# Altium project ProjectC.PrjPCB
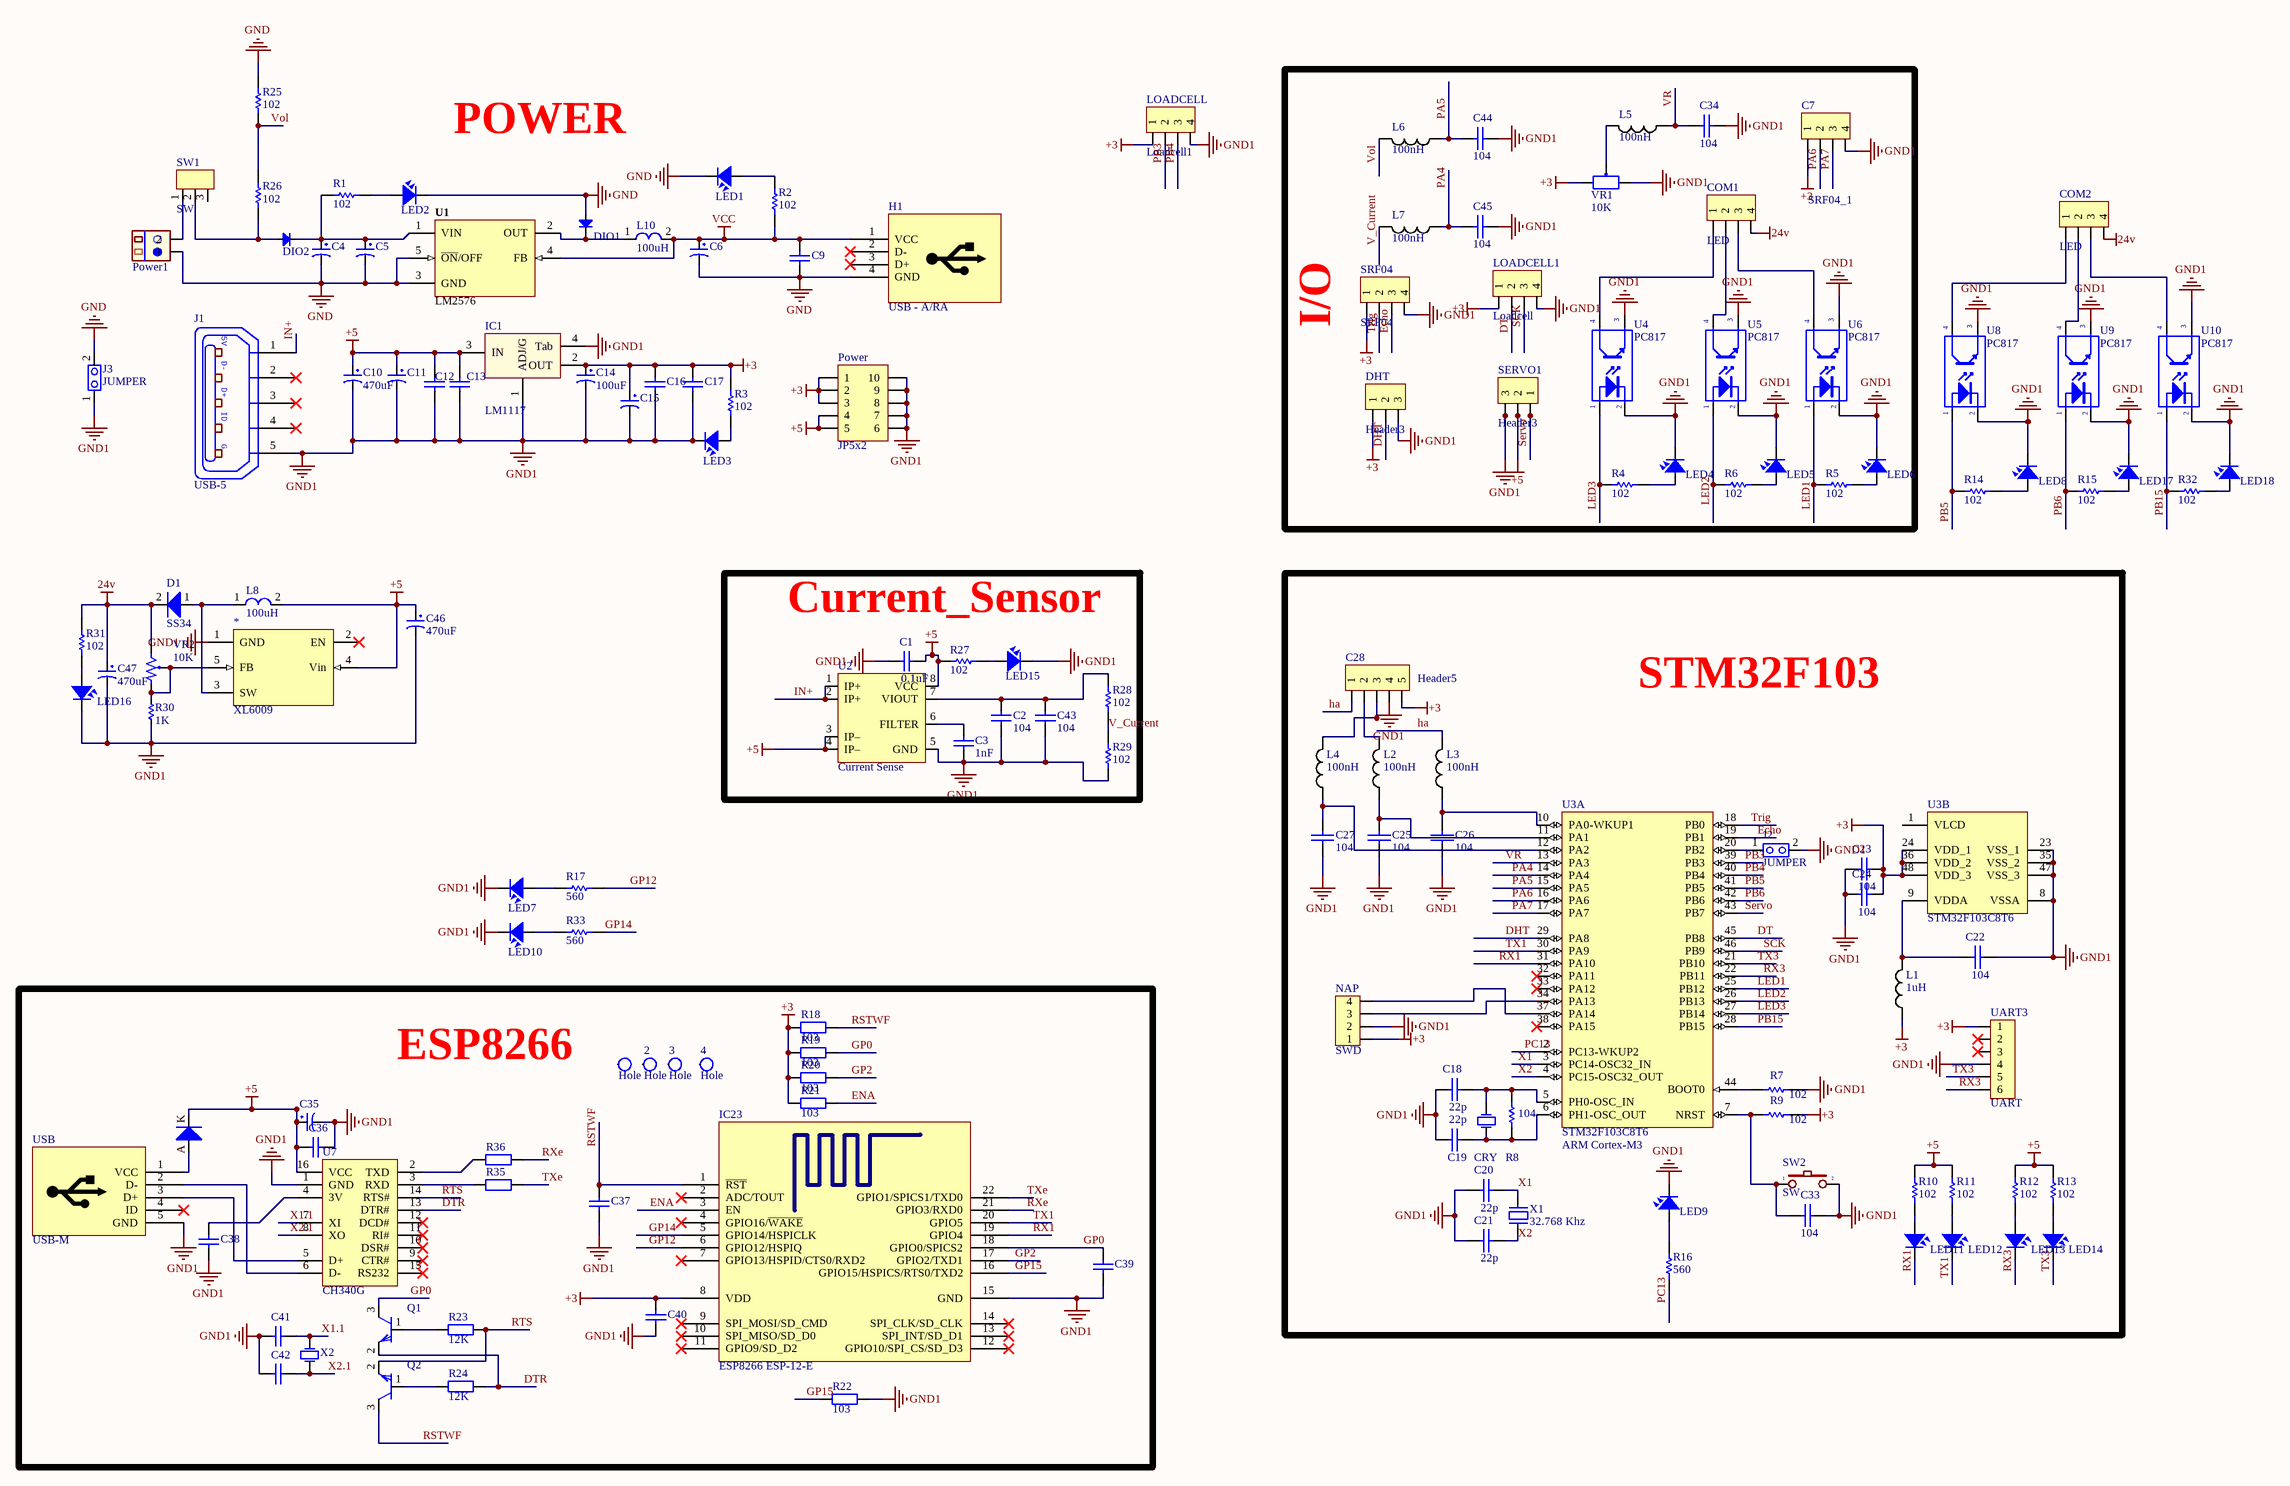
[diagram p0: IOT_ProjectC1.SchDoc]
1 sheet, 150 parts. Net scope: global (net labels, ports and power ports of the same name join across sheets).
Board file: IOT_ProjectC1.PcbDoc

## Sheet IOT_ProjectC1.SchDoc: IOT_ProjectC
size A2; Author: DUYNHAT; DrawnBy: DUYNHAT; Address1: EIU; ProjectName: IOT_PROJECT_C

### Parts
2  Hole  [Screw 3.0]
3  Hole  [Screw 3.0]
4  Hole  [Screw 3.0]
*  XL6009  [XL6009]
?  Hole  [Screw 3.0]
C1  0.1uF  [C0805]
C2  104  [C0805]
C3  1nF  [C0805]
C4  2200uF/50V  [CAP_xUF_50V_TH_13x20]  (value not drawn)
C5  2200uF/50V  [CAP_xUF_50V_TH_13x20]  (value not drawn)
C6  1000uF  [CAP_ALU_SIZEG]  (value not drawn)
C7  SRF04_1  [Header4]
C9  Capacitor Ceramic  [C0805]  (value not drawn)
C10  470uF  [CAP_ALU_SIZEF]
C11  470uF  [CAP_ALU_SIZEF]  (value not drawn)
C12  Capacitor Ceramic  [C0805]  (value not drawn)
C13  Capacitor Ceramic  [C0805]  (value not drawn)
C14  100uF  [CAP_ALU_SIZED8]
C15  100uF  [CAP_ALU_SIZED8]  (value not drawn)
C16  Capacitor Ceramic  [C0805]  (value not drawn)
C17  Capacitor Ceramic  [C0805]  (value not drawn)
C18  22p  [2012[0805]-C-A]
C19  22p  [2012[0805]-C-A]
C20  22p  [2012[0805]-C-A]
C21  22p  [2012[0805]-C-A]
C22  104  [2012[0805]-C-A]
C23  104  [2012[0805]-C-A]
C24  104  [2012[0805]-C-A]
C25  104  [2012[0805]-C-A]
C26  104  [2012[0805]-C-A]
C27  104  [2012[0805]-C-A]
C28  Header5  [Header5]
C33  104  [2012[0805]-C-A]
C34  104  [2012[0805]-C-A]
C35  10uF/16V  [CAP_ALU_SIZEB]  (value not drawn)
C36  Capacitor Ceramic  [C0805]  (value not drawn)
C37  Capacitor Ceramic  [C0805]  (value not drawn)
C38  Capacitor Ceramic  [C0805]  (value not drawn)
C39  Capacitor Ceramic  [C0805]  (value not drawn)
C40  Capacitor Ceramic  [C0805]  (value not drawn)
C41  Capacitor Ceramic  [C0805]  (value not drawn)
C42  Capacitor Ceramic  [C0805]  (value not drawn)
C43  104  [C0805]
C44  104  [2012[0805]-C-A]
C45  104  [2012[0805]-C-A]
C46  470uF  [CAP_ALU_SIZEF]
C47  470uF  [CAP_ALU_SIZEF]
COM1  LED  [Header4]
COM2  LED  [Header4]
CRY  Crysmd  [Crysmd]  (value not drawn)
D1  SS34  [SS34]
DHT  Header3  [Header3]
DIO1  Diode SMD  [DIO-SMD-106]  (value not drawn)
DIO2  Diode SMD  [DIO-SMD-106]  (value not drawn)
diode_1  1N4007  [1N4007]  (value not drawn)
H1  USB - A/RA  [USB-A-RA]
IC1  LM1117  [SOT223-4N]
IC23  ESP8266 ESP-12-E  [ESP8266 ESP-12-E]
J1  USB-5  [USB-M1]
J2  JUMPER  [JUMPER]
J3  JUMPER  [JUMPER]
L1  1uH  [TOKO-DFE252012C-1U]
L2  100nH  [TOKO-DFE252012C-1U]
L3  100nH  [TOKO-DFE252012C-1U]
L4  100nH  [TOKO-DFE252012C-1U]
L5  100nH  [TOKO-DFE252012C-1U]
L6  100nH  [TOKO-DFE252012C-1U]
L7  100nH  [TOKO-DFE252012C-1U]
L8  100uH  [L-SMD-M-12x10]
L10  100uH  [L-SMD-M-12x10]
LED1  LED  [LED-1206-Blue]  (value not drawn)
LED2  LED  [LED-1206-Blue]  (value not drawn)
LED3  LED  [LED-1206-Green]  (value not drawn)
LED4  LED  [LED-1206-Green]  (value not drawn)
LED5  LED  [LED-1206-Green]  (value not drawn)
LED6  LED  [LED-1206-Green]  (value not drawn)
LED7  LED  [LED-1206-Green]  (value not drawn)
LED8  LED  [LED-1206-Green]  (value not drawn)
LED9  LED  [LED-1206-Green]  (value not drawn)
LED10  LED  [LED-1206-Green]  (value not drawn)
LED11  LED  [LED-1206-Green]  (value not drawn)
LED12  LED  [LED-1206-Green]  (value not drawn)
LED13  LED  [LED-1206-Green]  (value not drawn)
LED14  LED  [LED-1206-Green]  (value not drawn)
LED15  LED  [LED-1206-Green]  (value not drawn)
LED16  LED  [LED-1206-Blue]  (value not drawn)
LED17  LED  [LED-1206-Green]  (value not drawn)
LED18  LED  [LED-1206-Green]  (value not drawn)
LOADCELL  Loadcell1  [Header4]
LOADCELL1  Loadcell  [Header4]
NAP  SWD  [Header4]
Power  JP5x2  [JP5-D2T]
Power1  CON.Domino2  [Domino 2N]  (value not drawn)
Q1  C1815  [SOT23N]  (value not drawn)
Q2  C1815  [SOT23N]  (value not drawn)
R1  102  [2012[0805]A]
R2  102  [2012[0805]A]
R3  102  [2012[0805]A]
R4  102  [2012[0805]A]
R5  102  [2012[0805]A]
R6  102  [2012[0805]A]
R7  102  [2012[0805]A]
R8  104  [2012[0805]A]
R9  102  [2012[0805]A]
R10  102  [2012[0805]A]
R11  102  [2012[0805]A]
R12  102  [2012[0805]A]
R13  102  [2012[0805]A]
R14  102  [2012[0805]A]
R15  102  [2012[0805]A]
R16  560  [2012[0805]A]
R17  560  [2012[0805]A]
R18  value 103  [DIEN TRO 0805]  (hidden comment: RES_SMD_0805)
R19  value 103  [DIEN TRO 0805]  (hidden comment: RES_SMD_0805)
R20  value 103  [DIEN TRO 0805]  (hidden comment: RES_SMD_0805)
R21  value 103  [DIEN TRO 0805]  (hidden comment: RES_SMD_0805)
R22  value 103  [DIEN TRO 0805]  (hidden comment: RES_SMD_0805)
R23  value 12K  [DIEN TRO 0805]  (hidden comment: RES_SMD_0805)
R24  value 12K  [DIEN TRO 0805]  (hidden comment: RES_SMD_0805)
R25  102  [2012[0805]A]
R26  102  [2012[0805]A]
R27  102  [2012[0805]A]
R28  102  [2012[0805]A]
R29  102  [2012[0805]A]
R30  1K  [RES-SMD-0805]
R31  102  [2012[0805]A]
R32  102  [2012[0805]A]
R33  560  [2012[0805]A]
R35  RES_SMD_0805  [DIEN TRO 0805]  (value not drawn)
R36  RES_SMD_0805  [DIEN TRO 0805]  (value not drawn)
SERVO1  Header3  [Header3]
SRF04  SRF04  [Header4]
SW1  SW  [MTS-102]
SW2  SW  [SW1-SMD]
U1  LM2576  [TO263]
U2  Current Sense  [SOIC8N]
U3  STM32F103C8T6  Core: ARM Cortex-M3  [STM32F103C8T6-LQFP48_N]  (parts A,B of 2)
U4  PC817  [OPTO_SMD]
U5  PC817  [OPTO_SMD]
U6  PC817  [OPTO_SMD]
U7  CH340G  [SO16]
U8  PC817  [OPTO_SMD]
U9  PC817  [OPTO_SMD]
U10  PC817  [OPTO_SMD]
UART3  UART  [Header6]
USB  USB-M  [USB-B-Mini]
VR1  10K  [VR]
VR2  10K  [VR1]
X1  32.768 Khz  [XT2-32.768KHz-2_V]
X2  Crysmd  [Crysmd]  (value not drawn)

### Blocks framed on the sheet
I/O: C7 C34 C44 C45 COM1 DHT L5-L7 LED4-LED6 LOADCELL1 R4-R6 SERVO1 SRF04 U4-U6 VR1
Current_Sensor: C1-C3 C43 LED15 R27-R29 U2
STM32F103: C18-C28 C33 CRY J2 L1-L4 LED9 LED11-LED14 NAP R7-R13 R16 SW2 U3 UART3 X1
ESP8266: 2-4 ? C35-C42 diode_1 IC23 Q1 Q2 R18-R24 R35 R36 U7 USB X2

### Nets
24v: C47.1 COM1.4 COM2.4 D1.2(K) R31.2 VR2.3
+3: C7.1 C14.1 C15.1 C16.2 C17.2 C23.1 C24.1 C28.5 C40.2 DHT.1 IC1.2(OUT) IC23.8(VDD) L1.1 LOADCELL.1 LOADCELL1.1 NAP.1 Power.1 Power.2 Power.3 R3.2 R9.1 R18.1 R19.1 R20.1 R21.1 SRF04.1 U3.24(VDD_1) U3.36(VDD_2) U3.48(VDD_3) UART3.1 VR1.1
+5: *.4(Vin) C1.2 C10.1 C11.1 C12.2 C13.2 C35.1 C36.1 C46.1 diode_1.K IC1.3(IN) L8.2 Power.4 Power.5 R10.1 R11.1 R12.1 R13.1 R27.2 SERVO1.2 U2.3(IP–) U2.4(IP–) U2.8(VCC) U7.16(VCC)
GND: C4.2 C5.2 C6.2 C9.1 DIO1.1(A) H1.4(GND) J3.2 LED1.2 LED2.2 Power1.1 R25.2 U1.3(GND) U1.5(~{ON}/OFF)
GND1: *.1(GND) C1.1 C2.1 C3.1 C7.4 C10.2 C11.2 C12.1 C13.1 C14.2 C15.2 C16.1 C17.1 C18.2 C19.2 C20.2 C21.2 C22.1 C23.2 C24.2 C25.2 C26.2 C27.2 C28.4 C33.2 C34.2 C35.2 C36.2 C37.1 C38.1 C39.1 C40.1 C41.1 C42.1 C43.1 C44.2 C45.2 C46.2 C47.2 DHT.3 IC1.1(ADJ/G) IC1.4(Tab) IC23.15(GND) J1.5(P5) J2.2 J3.1 LED3.2 LED4.2 LED5.2 LED6.2 LED7.2 LED8.2 LED9.2 LED10.2 LED15.2 LED16.2 LED17.2 LED18.2 LOADCELL.4 LOADCELL1.4 NAP.2 Power.6 Power.7 Power.8 Power.9 Power.10 R7.1 R22.2 R29.2 R30.2 SERVO1.3 SRF04.4 SW2.2 U2.5(GND) U3.8(VSSA) U3.23(VSS_1) U3.35(VSS_2) U3.47(VSS_3) U4.2(K) U4.3(E) U5.2(K) U5.3(E) U6.2(K) U6.3(E) U7.1(GND) U8.2(K) U8.3(E) U9.2(K) U9.3(E) U10.2(K) U10.3(E) UART3.4 USB.5(GND) VR1.3
VCC: C6.1 C9.2 H1.1(VCC) L10.2 R2.2 U1.4(FB)
DHT: DHT.2 U3.29(PA8)
DT: LOADCELL1.2 U3.45(PB8)
DTR: Q1.2(E) R24.2 U7.13(DTR#)
Echo: SRF04.3 U3.19(PB1)
ENA: IC23.3(EN) R21.2
GP0: C39.2 IC23.18(GPIO0/SPICS2) Q1.3(C) R19.2
GP2: IC23.17(GPIO2/TXD1) R20.2
GP12: IC23.6(GPIO12/HSPIQ) R17.2
GP14: IC23.5(GPIO14/HSPICLK) R33.2
GP15: IC23.16(GPIO15/HSPICS/RTS0/TXD2) R22.1
ha: C28.1 L3.2
IN+: J1.1(P1) U2.1(IP+) U2.2(IP+)
LED1: R5.2 U3.25(PB12) U6.1(A)
LED2: R6.2 U3.26(PB13) U5.1(A)
LED3: R4.2 U3.27(PB14) U4.1(A)
PA4: C45.1 L7.1 U3.14(PA4)
PA5: C44.1 L6.1 U3.15(PA5)
PA6: C7.2 U3.16(PA6)
PA7: C7.3 U3.17(PA7)
PB3: LOADCELL.2 U3.39(PB3)
PB4: LOADCELL.3 U3.40(PB4)
PB5: R14.2 U3.41(PB5) U8.1(A)
PB6: R15.2 U3.42(PB6) U9.1(A)
PB15: R32.2 U3.28(PB15) U10.1(A)
PC13: R16.2 U3.2(PC13-WKUP2)
RSTWF: C37.2 IC23.1(~{RST}) Q2.3(C) R18.2
RTS: Q2.2(E) R23.2 U7.14(RTS#)
RX1: IC23.19(GPIO4) LED11.2 U3.31(PA10)
RX3: LED13.2 U3.22(PB11) UART3.6
RXe: IC23.21(GPIO3/RXD0) R36.2
SCK: LOADCELL1.3 U3.46(PB9)
Servo: SERVO1.1 U3.43(PB7)
Trig: SRF04.2 U3.18(PB0)
TX1: IC23.20(GPIO5) LED12.2 U3.30(PA9)
TX3: LED14.2 U3.21(PB10) UART3.5
TXe: IC23.22(GPIO1/SPICS1/TXD0) R35.2
V_Current: L7.2 R28.1 R29.1
Vol: L6.2 R25.1 R26.2
VR: C34.1 L5.1 U3.13(PA3)
X1: C20.1 U3.3(PC14-OSC32_IN) X1.2
X1.1: C41.2 U7.7(XI) X2.2(OSC2)
X2: C21.1 U3.4(PC15-OSC32_OUT) X1.1
X2.1: C42.2 U7.8(XO) X2.1(OSC1)
Net*_3: *.3(SW) D1.1(A) L8.1
Net*_5: *.5(FB) R30.1 VR2.1 VR2.2
NetC2_2: C2.2 C43.2 R28.2 U2.7(VIOUT)
NetC3_2: C3.2 U2.6(FILTER)
NetC4_1: C4.1 C5.1 DIO2.2(K) R1.1 U1.1(VIN)
NetC18_1: C18.1 CRY.2(OSC2) R8.2 U3.5(PH0-OSC_IN)
NetC19_1: C19.1 CRY.1(OSC1) R8.1 U3.6(PH1-OSC_OUT)
NetC22_2: C22.2 L1.2 U3.9(VDDA)
NetC25_1: C25.1 L2.1 U3.11(PA1)
NetC26_1: C26.1 L3.1 U3.10(PA0-WKUP1)
NetC27_1: C27.1 L4.1 U3.12(PA2)
NetC28_2: C28.2 L2.2
NetC28_3: C28.3 L4.2
NetC33_1: C33.1 R9.2 SW2.1 U3.7(NRST)
NetC38_2: C38.2 U7.4(3V)
NetCOM1_1: COM1.1 U4.4(C)
NetCOM1_2: COM1.2 U5.4(C)
NetCOM1_3: COM1.3 U6.4(C)
NetCOM2_1: COM2.1 U8.4(C)
NetCOM2_2: COM2.2 U9.4(C)
NetCOM2_3: COM2.3 U10.4(C)
NetDIO1_2: DIO1.2(K) L10.1 U1.2(OUT)
NetDIO2_1: DIO2.1(A) R26.1 SW1.2
Netdiode_1_A: diode_1.A USB.1(VCC)
NetJ2_1: J2.1 U3.20(PB2)
NetL5_2: L5.2 VR1.2
NetLED1_1: LED1.1 R2.1
NetLED2_1: LED2.1 R1.2
NetLED3_1: LED3.1 R3.1
NetLED4_1: LED4.1 R4.1
NetLED5_1: LED5.1 R6.1
NetLED6_1: LED6.1 R5.1
NetLED7_1: LED7.1 R17.1
NetLED8_1: LED8.1 R14.1
NetLED9_1: LED9.1 R16.1
NetLED10_1: LED10.1 R33.1
NetLED11_1: LED11.1 R10.2
NetLED12_1: LED12.1 R11.2
NetLED13_1: LED13.1 R12.2
NetLED14_1: LED14.1 R13.2
NetLED15_1: LED15.1 R27.1
NetLED16_1: LED16.1 R31.1
NetLED17_1: LED17.1 R15.1
NetLED18_1: LED18.1 R32.1
NetNAP_3: NAP.3 U3.34(PA13)
NetNAP_4: NAP.4 U3.37(PA14)
NetPower1_2: Power1.2 SW1.1
NetQ1_1: Q1.1(B) R23.1
NetQ2_1: Q2.1(B) R24.1
NetR7_2: R7.2 U3.44(BOOT0)
NetR35_1: R35.1 U7.3(RXD)
NetR36_1: R36.1 U7.2(TXD)
NetU7_5: U7.5(D+) USB.3(D+)
NetU7_6: U7.6(D-) USB.2(D-)

Not connected (* = marked no-connect by the designer): 2 1; 3 1; 4 1; * 2(EN)*; ? 1; H1 2(D-)* 3(D+)* 5 6; IC23 2(ADC/TOUT)* 4(GPIO16/~{WAKE})* 7(GPIO13/HSPID/CTS0/RXD2)* 9(SPI_MOSI/SD_CMD)* 10(SPI_MISO/SD_D0)* 11(GPIO9/SD_D2)* 12(GPIO10/SPI_CS/SD_D3)* 13(SPI_INT/SD_D1)* 14(SPI_CLK/SD_CLK)*; J1 2(P2)* 3(P3)* 4(P4)*; SW1 3(1); U3 1(VLCD) 32(PA11)* 33(PA12)* 38(PA15)*; U7 9(CTR#)* 10(DSR#)* 11(RI#)* 12(DCD#)* 15(RS232)*; UART3 2* 3*; USB 4(ID)*

### Notes on the sheet
- POWER
- Title
- Size:
- Date:
- File:
- A2
- Number:
- Time:
- Revision:
- Sheet
- of
- (in symbol USB-5) 5V; D-; D+; ID; G

### Library data of the parts
C1-C3 C9 C12 C13 C16 C17 C36-C43 = CapSMD: Capacitor; Value: 33p; Published: 8-Jun-2000; LatestRevisionDate: 17-Jul-2002; LatestRevisionNote: Re-released for DXP Platform.; PackageReference: RAD-0.3; Publisher: Altium Limited
C4 C5 = CAP_ALU/CHE_2200uF_50V_POL_18x40: Use for 2200uF Capacitor Through Hole
C6 = CAP_ALU_1000uF_10V_POL_SMD: Aluminum Capacitor 680uF size G
C7 COM1 COM2 LOADCELL LOADCELL1 NAP SRF04 = Header4: Header IDC, 4 x 1 Pin Vertical 2.54mm Pitch (Non-Boxed, Male); Manufacturer: W¨¹rth Elektronik eiSos GmbH; partNo: 613002143121; ComponentLink1 Description: Manufacturer; ComponentLink2 Description: Datasheet; NoPins: 02; Created Date: 29 March 2013; ComponentLink1URL: http://www.we-online.com; ComponentLink2URL: http://katalog.we-online.de/em/datasheet/6130xx143121.pdf; Created by: Karrer Zheng
C10 C11 C46 C47 = CAP_ALU_470uF_16V_POL_SMD: Aluminum Capacitor 220uF size F
C14 C15 = CAP_ALU_100uF_35V_POL_SMD: Aluminum Capacitor 100uF size D
C18-C27 C33 C34 C44 C45 = 2012[0805]_Chip_Capacitor: Thick Film Chip Capacitor, 0805 Size; Note: If flow soldering, adjust pad width of PCB Footprint to 0.7 - 0.8 times the width of the resistor.; LatestReviewer: Fenrrich; ComponentDescription: Thick Film Chip Resistor, 0805 Size; Published: 28-08-2017; LatestRevisionDate: 08-05-2019; LatestRevisionNote: 3D model modified, Silkscreen modified.; PackageReference: 0805; Publisher: Cynetik Group; Code_IPC: 2012[0805]; ComponentLink1Description: Manufacturer Link; ComponentLink2Description: Datasheet
C28 = Header5: Header IDC, 5 x 1 Pin Vertical 2.54mm Pitch (Non-Boxed, Male); Manufacturer: W¨¹rth Elektronik eiSos GmbH; partNo: 613002143121; ComponentLink1 Description: Manufacturer; ComponentLink2 Description: Datasheet; NoPins: 02; Created Date: 29 March 2013; ComponentLink1URL: http://www.we-online.com; ComponentLink2URL: http://katalog.we-online.de/em/datasheet/6130xx143121.pdf; Created by: Karrer Zheng
C35 = CAP_ALU_10uF_16V_POL_SMD: Aluminum Capacitor 10uF size B
DHT SERVO1 = Header3: Header IDC, 3 x 1 Pin Vertical 2.54mm Pitch (Non-Boxed, Male); Manufacturer: W¨¹rth Elektronik eiSos GmbH; partNo: 613002143121; ComponentLink1 Description: Manufacturer; ComponentLink2 Description: Datasheet; NoPins: 02; Created Date: 29 March 2013; ComponentLink1URL: http://www.we-online.com; ComponentLink2URL: http://katalog.we-online.de/em/datasheet/6130xx143121.pdf; Created by: Karrer Zheng
DIO1 DIO2 = Diode SMD: Default Diode; Code - JEDEC: DO-214-AB; Value: 1N5007; Published: 8-Jun-2000; Revision: July-2002: Re-released for DXP Platform.; Publisher: Altium Limited
diode_1 = 1N4007: Diode LS 1A 1000V DO-41
IC1 = LM1117_2: 3v3; Value: LM317
J1 = USB-5: Manufacturer: FCI; Manufacturer Part Number: 10118193-0001LF; Connector Type: USB - micro B; Number of Contacts: 5; Gender: Receptacle; Specifications: USB 2.0; .Creator: MM; .Checked PCB: RF; Supplier 1: Digi-Key; RoHS: RoHS Compliant; Category: Connectors, Interconnects; Stock 1: 28642; Pricing 1: 1=0.46, 10=0.433, 25=0.3712, 50=0.3156, 100=0.3032, 250=0.27224, 500=0.25988 (USD); Packaging: Cut Tape (CT); Mounting Type: Surface Mount, Right Angle, Horizontal; Features: Shielded, Solder Retention; Ingress Protection: -; ComponentLink1URL: http://portal.fciconnect.com/Comergent//fci/drawing/10118193.pdf; ComponentLink1Description: http://portal.fciconnect.com/Comergent//fci/drawing/10118193.pdf; Supplier Part Number 1: 609-4616-1-ND; .Checked SCH: MM
L1-L7 = 1U-1239AS-TOKO: 1239AS-H-1R0N
L8 L10 = L-SMD-1: partNo: 78477010; Manufacturer: Wurth Elektronik; Inductance: 1.0 μH; ComponentLink1Description: Manufacturer; ComponentLink1URL: http://www.we-online.de; Created by: Baojun Chen; Created Date: Nov.2015; ComponentLink2Description: Datasheet; ComponentLink2URL: http://katalog.we-online.de/pbs/datasheet/78477010.pdf
LED1-LED18 = LED SMD: Value: LED 3 - 5 ly 2 Colour
Power = JP5x2: WR-PHD 2.54 mm Dual Socket Header; Manufacturer: W¨¹rth Elektronik eiSos GmbH; partNo: 61301021821; ComponentLink1 Description: Manufacturer; ComponentLink2 Description: Datasheet; NoPins: 10; Created Date: 29 March 2013; ComponentLink1URL: http://www.we-online.com; ComponentLink2URL: http://katalog.we-online.de/em/datasheet/6130xx21821.pdf; Created by: Karrer Zheng
Power1 = CON.Domino2: 2 pins Domino Header; Publisher: Hoang Nguyen; ComponentLink1Description: Digikey Part link; ComponentLink2Description: Open DataSheet; ComponentLink2URL: H:\LIBRARY\LIBRARY.Datasheet\; Price: 2000VND
Q1 Q2 = C1815: Q2SC1815; PSpiceTemplate: Q^@REFDES %c %b %e @MODEL; Vendor: Digikey; COMPONENT: 2SC1815; Published: 13-April-2009; Publisher: Hoang Nguyen; ComponentLink1Description: Digikey Part Link; ComponentLink2Description: Open Datasheet; ComponentLink2URL: H:\LIBRARY\LIBRARY.Datasheet\; Price: 500VND
R1-R17 R25-R29 R31-R33 = 2012[0805]_Chip_Resistor: Thick Film Chip Resistor, 0805 Size; Note: If flow soldering, adjust pad width of PCB Footprint to 0.7 - 0.8 times the width of the resistor.; LatestReviewer: Fenrrich; Published: 28-08-2017; LatestRevisionDate: 08-05-2019; LatestRevisionNote: 3D Body modificated, skillscreen modificated; PackageReference: 0805; Publisher: Cynetik Group; Code_IPC: 2012[0805]; ComponentLink1Description: Manufacturer Link; ComponentLink2Description: Datasheet; ComponentDescription: Thick Film Chip Resistor, 0805 Size
R18-R24 = RES_SMD_0805: RES_0805; Published: 8-Jun-2000; LatestRevisionDate: 17-Jul-2002; LatestRevisionNote: Re-released for DXP Platform.; PackageReference: AXIAL-0.4; Publisher: Altium Limited
R30 = Res-SMD: Resistor; Manufacturer: Generic Components; Class: Passive; Published: 08/06/2000; Publisher: Altium Hobart Technology Centre
R35 R36 = RES_SMD_0805: RES_0805; Value: 0805; Published: 8-Jun-2000; LatestRevisionDate: 17-Jul-2002; LatestRevisionNote: Re-released for DXP Platform.; PackageReference: AXIAL-0.4; Publisher: Altium Limited
SW1 = Switch
SW2 = SW2: Switch button 2 pin; Value: SW chip 2 pin
U1 = LM2576_1: Max Input Voltage: 12 V; Max Output Current: 3 (6.0 peak) A; Max Output Voltage: mV; Category: IC-Power; Min Input Voltage: mV; Min Output Voltage: mV; Mounting Technology: Surface Mount; Status: Unreleased; Supply Voltage: mV; Temperature Range: -40 to +125 degC
U2 = ACS712_xxA: Current Sense IC
U3 = STM32F103C8T6: Medium-density performance line ARM®-based 32-bit MCU with 64 / or 128 KB Flash, USB, CAN, 7 timers, 2 ADCs, 9 com. interfaces; I/Os (High Current): 37; Packing: Tape and Reel; Operating Frequency(F) (Processor speed) (MHz): 72; Supply Voltage(Vcc) min (V): 1.65; PackageDescription: 48-Pin Low Profile Quad Flat Package, 7 x 7 mm Body, 0.5 mm Pitch; ComponentLink3Description: Package Specification; ComponentLink2Description: Datasheet; Mounting Technology: Surface Mount; PackageVersion: Rev. 6, 06/2013; PartNumber: STM32F103C8T6; ComponentLink3URL: https://www.st.com/resource/en/datasheet/stm32f103c8.pdf; DatasheetVersion: DocID13587 Rev 17; ComponentLink2URL: https://www.st.com/resource/en/datasheet/stm32f103c8.pdf; ComponentLink1Description: Manufacturer URL; ComponentLink1URL: http://www.st.com/web/en/home.html; PackageReference: LQFP48
U4-U6 U8-U10 = PC817_1: Single Opto; Value: PC817
U7 = CH340G: High and Low Side Driver; Note: Pins 4, 8 and 14 are not connected; Published: 8-Jun-2000; LatestRevisionDate: 04-Mar-2005; LatestRevisionNote: Stylized 3D Model Added.; DatasheetVersion: PD60147J; PackageReference: PDIP14; Publisher: Altium Limited; PackageDescription: DIP; 14 Leads; Row Spacing 7.62 mm; Pitch 2.54 mm; ComponentLink1Description: Manufacturer Link; ComponentLink1URL: http://www.irf.com/; ComponentLink2Description: Datasheet; ComponentLink2URL: http://www.irf.com/product-info/datasheets/data/ir2110.pdf
UART3 = Header6: Header IDC, 6 x 1 Pin Vertical 2.54mm Pitch (Non-Boxed, Male); Manufacturer: W¨¹rth Elektronik eiSos GmbH; partNo: 613002143121; ComponentLink1 Description: Manufacturer; ComponentLink2 Description: Datasheet; NoPins: 02; Created Date: 29 March 2013; ComponentLink1URL: http://www.we-online.com; ComponentLink2URL: http://katalog.we-online.de/em/datasheet/6130xx143121.pdf; Created by: Karrer Zheng
VR1 = VR: Var Resistor; Value: VR 10K
VR2 = VR1: Var Resistor; Value: VR 10K
X1 = XT2_1: Crystal, 32.768 KHz, -40 to 85 degC, 3.2 x 1.5 x 0.9 mm SMD; Value: 4Mhz